# Altium schematic sheet Antena.SchDoc
size A4
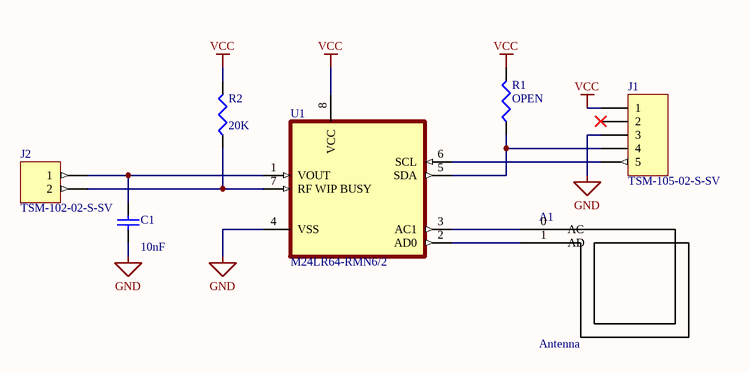
[diagram p0: Antena.SchDoc]

## Parts
A1  Antenna  [Antenna1]
C1  value 10nF  [C1206]  (hidden comment: Cap Semi)
J1  TSM-105-02-S-SV  [HDR1X5]
J2  TSM-102-02-S-SV  [HDR1X2]
R1  OPEN  [J1-0603]
R2  value 20K  [J1-0603]
U1  M24LR64-RMN6/2  [SOIC127P600X175-8N]

## Nets
GND: C1.1 J1.3 U1.4(VSS)
VCC: J1.1 R1.2 R2.2 U1.8(VCC)
NetA1_0: A1.0(AC) U1.3(AC1)
NetA1_1: A1.1(AD) U1.2(AD0)
NetC1_2: C1.2 J2.1 U1.1(VOUT)
NetJ1_4: J1.4 R1.1 U1.5(SDA)
NetJ1_5: J1.5 U1.6(SCL)
NetJ2_2: J2.2 R2.1 U1.7(RF_WIP_BUSY)

Not connected (* = marked no-connect by the designer): J1 2*

## Library data of the parts
C1 = Cap Semi: Capacitor (Semiconductor SIM Model); Published: 8-Jun-2000; LatestRevisionDate: 29-May-2009; LatestRevisionNote: IPC-7351 Footprint Added.; PackageReference: C1206; Publisher: Altium Limited; PackageDescription: Chip Capacitor
J1 = Header 5: LatestRevisionDate: 17-Jul-2002; LatestRevisionNote: Re-released for DXP Platform.; Publisher: Altium Limited
J2 = Header 2: Header, 2-Pin; LatestRevisionDate: 17-Jul-2002; LatestRevisionNote: Re-released for DXP Platform.; Publisher: Altium Limited
R1 = Res3: Resistor; Value: 20K; Published: 8-Jun-2000; LatestRevisionDate: 29-May-2009; LatestRevisionNote: IPC-7351 Footprint Added.; PackageReference: J1-0603; Publisher: Altium Limited; PackageDescription: Chip Resistor
R2 = Res3: Resistor; Published: 8-Jun-2000; LatestRevisionDate: 29-May-2009; LatestRevisionNote: IPC-7351 Footprint Added.; PackageReference: J1-0603; Publisher: Altium Limited; PackageDescription: Chip Resistor
U1 = M24LR64-RMN6/2: 64 Kbit EEPROM; Manufacturer 1: STMicroelectronics; Manufacturer Part Number 1: M24LR16E-RMN6T/2; MP: M24LR64-RMN6-2; Interface: I2C,2-Wire,Serial; Frequency: 400kHz; Access Time: 900ns; Density: 16Kb; Max Frequency: 13.56MHz; Min Supply Voltage: 1.8V; Max Supply Voltage: 5.5V; Nominal Supply Current: 500uA; Organization: 2KX8; Write Protection: YES; Number of Words: 2048; Package: None; Price: None; Value: *; Availability: Unavailable; Supplier 1: Digi-Key; Stock 1: 7462; Pricing 1: 1=1,69000, 10=1,50000, 25=1,35520, 100=1,18580, 250=1,04060, 500=0,91960, 1000=0,84700 (USD); RoHS: Yes; Mount: Surface Mount; Case/Package: SOIC; Number of Pins: 8; Min Operating Temperature: -40°C; Max Operating Temperature: 85°C; Packaging: Tape and Reel; Package Quantity: 1; Series: -; Memory Size: 16Kb; Access Time-Max: 900ns; Programming Voltage: 5.5V; Supply Current: 500uA; Length: 5mm; Width: 4mm; Height: 1.25mm; Depth: 4mm; Radiation Hardening: No; Reach SVHC Compliant: Yes; Lead Free: Lead Free; RoHS Compliant: Yes; ComponentLink1URL: https://datasheet.ciiva.com/2803/en-dm00031737-2803398.pdf?src-supplier=Digi-Key; ComponentLink1Description: https://datasheet.ciiva.com/2803/en-dm00031737-2803398.pdf?src-supplier=Digi-Key